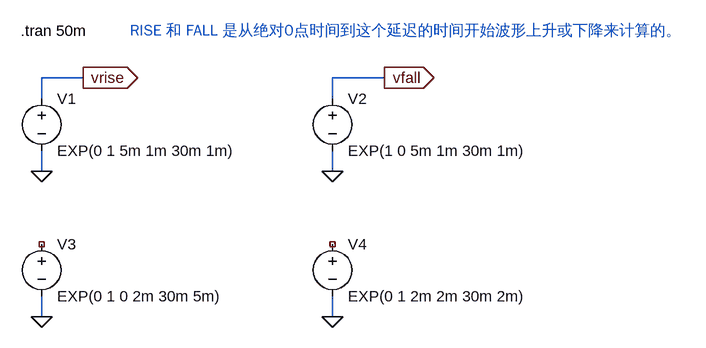
[diagram p0: schematic 06_EXPWave.asc]
06_EXPWave.asc, the LTspice schematic file:
Version 4
SHEET 1 920 680
WIRE 48 160 -16 160
WIRE 512 160 432 160
WIRE -16 192 -16 160
WIRE 432 192 432 160
WIRE -16 304 -16 272
WIRE 432 304 432 272
WIRE -16 528 -16 496
WIRE 432 528 432 496
FLAG -16 304 0
FLAG 48 160 vrise
IOPIN 48 160 Out
FLAG 432 304 0
FLAG 512 160 vfall
IOPIN 512 160 Out
FLAG -16 528 0
FLAG 432 528 0
SYMBOL Voltage -16 176 R0
SYMATTR InstName V1
SYMATTR Value EXP(0 1 5m 1m 30m 1m)
SYMBOL Voltage 432 176 R0
SYMATTR InstName V2
SYMATTR Value EXP(1 0 5m 1m 30m 1m)
SYMBOL Voltage -16 400 R0
SYMATTR InstName V3
SYMATTR Value EXP(0 1 0 2m 30m 5m)
SYMBOL Voltage 432 400 R0
SYMATTR InstName V4
SYMATTR Value EXP(0 1 2m 2m 30m 2m)
TEXT -48 88 Left 2 !.tran 50m
TEXT 120 88 Left 2 ;RISE 和 FALL 是从绝对0点时间到这个延迟的时间开始波形上升或下降来计算的。

The netlist it stands for:
* 06_EXPWave.asc
V1 vrise 0 EXP(0 1 5m 1m 30m 1m)
V2 vfall 0 EXP(1 0 5m 1m 30m 1m)
V3 NC_01 0 EXP(0 1 0 2m 30m 5m)
V4 NC_02 0 EXP(0 1 2m 2m 30m 2m)
.tran 50m
* RISE 和 FALL 是从绝对0点时间到这个延迟的时间开始波形上升或下降来计算的。
.backanno
.end